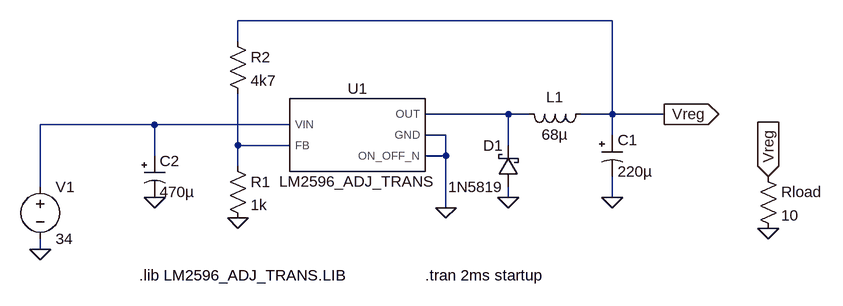
[diagram p0: schematic lm2596.asc]
lm2596.asc, the LTspice schematic file:
Version 4
SHEET 1 1152 680
WIRE 832 112 256 112
WIRE 256 144 256 112
WIRE 672 256 544 256
WIRE 704 256 672 256
WIRE 832 256 832 112
WIRE 832 256 784 256
WIRE 912 256 832 256
WIRE 128 272 -48 272
WIRE 336 272 128 272
WIRE 576 288 544 288
WIRE 832 288 832 256
WIRE 256 304 256 224
WIRE 336 304 256 304
WIRE 672 304 672 256
WIRE 128 320 128 272
WIRE 576 320 576 288
WIRE 576 320 544 320
WIRE 256 336 256 304
WIRE -48 368 -48 272
WIRE 672 384 672 368
WIRE 832 384 832 352
WIRE 576 400 576 320
WIRE -48 464 -48 448
FLAG -48 464 0
FLAG 576 400 0
FLAG 256 416 0
FLAG 832 384 0
FLAG 128 384 0
FLAG 672 384 0
FLAG 912 256 Vreg
IOPIN 912 256 Out
FLAG 1072 432 0
FLAG 1072 352 Vreg
IOPIN 1072 352 In
SYMBOL Voltage -48 352 R0
SYMATTR InstName V1
SYMATTR Value 34
SYMBOL Res 240 320 R0
SYMATTR InstName R1
SYMATTR Value 1k
SYMBOL Res 240 128 R0
SYMATTR InstName R2
SYMATTR Value 4k7
SYMBOL ind 800 240 R90
WINDOW 0 5 56 VBottom 2
WINDOW 3 32 56 VTop 2
SYMATTR InstName L1
SYMATTR Value 68µ
SYMBOL polcap 816 288 R0
SYMATTR InstName C1
SYMATTR Value 220µ
SYMBOL polcap 112 320 R0
SYMATTR InstName C2
SYMATTR Value 470µ
SYMBOL schottky 688 368 R180
WINDOW 0 24 64 Left 2
WINDOW 3 24 0 Left 2
SYMATTR InstName D1
SYMATTR Value 1N5819
SYMBOL Res 1056 336 R0
SYMATTR InstName Rload
SYMATTR Value 10
SYMBOL LM2596_ADJ_TRANS 432 288 R0
SYMATTR InstName U1
TEXT 104 504 Left 2 !.lib LM2596_ADJ_TRANS.LIB
TEXT 544 504 Left 2 !.tran 2ms startup

The netlist it stands for:
* lm2596.asc
V1 N002 0 34
R1 N003 0 1k
R2 Vreg N003 4k7
L1 Vreg N001 68µ
C1 Vreg 0 220µ
C2 N002 0 470µ
D1 0 N001 1N5819
Rload Vreg 0 10
XU1 N002 N003 N001 0 0 LM2596_ADJ_TRANS  ; pins VIN FB OUT GND ON_OFF_N
.model D D
.lib standard.dio
.lib LM2596_ADJ_TRANS.LIB
.tran 2ms startup
.lib /Users/marcobrattinga/GITREPO/architolk.github.io/assets/spice/calculator/LM2596_ADJ_TRANS.LIB
.backanno
.end